# Altium schematic sheet Input_Power.SchDoc
size A; SheetNumber: 5; SheetTotal: 6
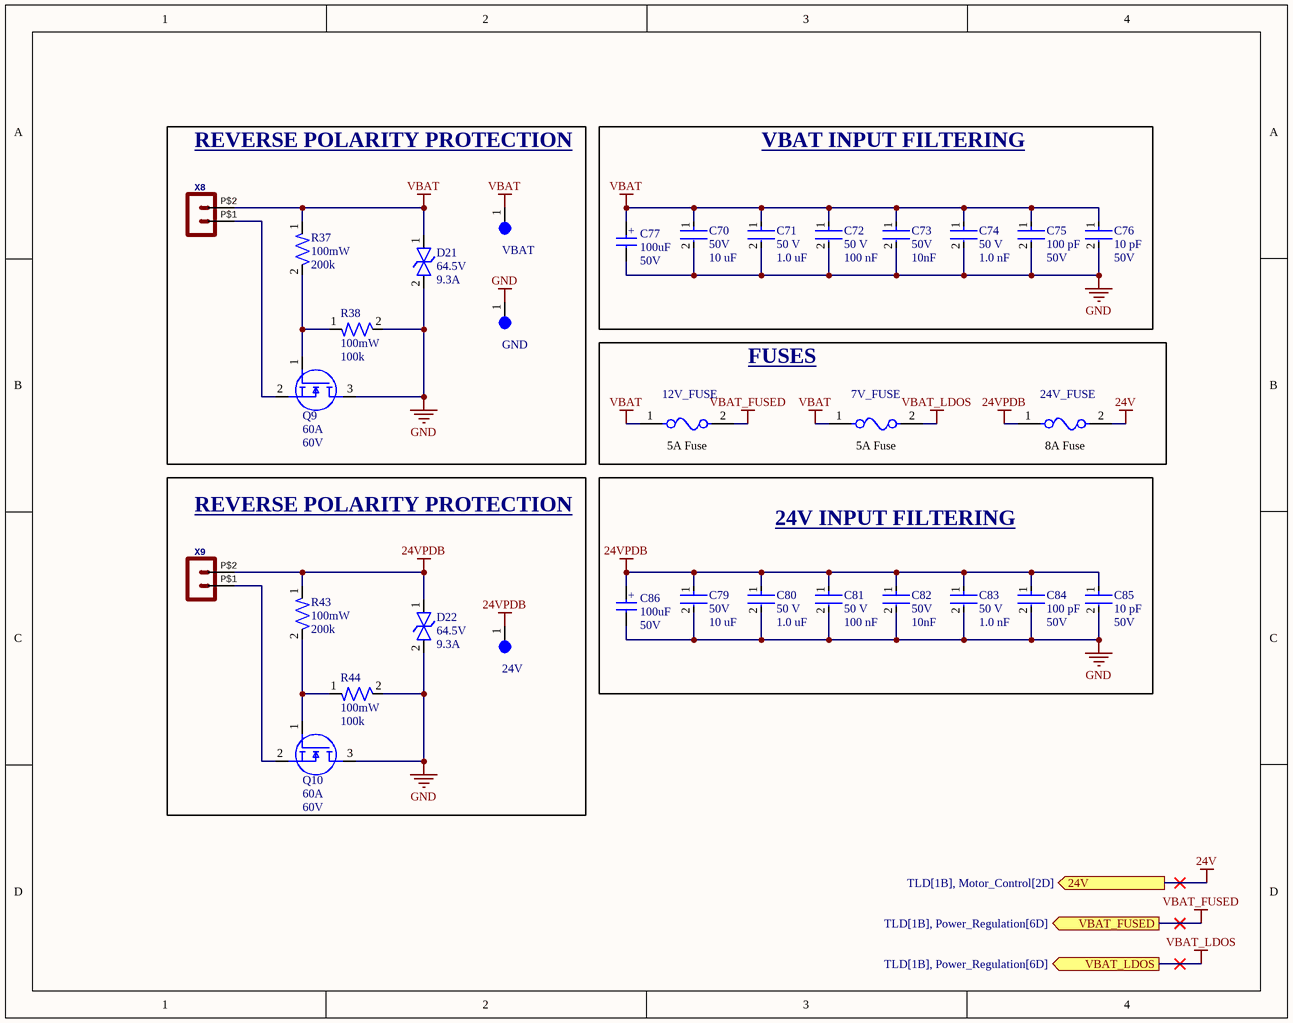
[diagram p0: Input_Power.SchDoc]

## Parts
7V_FUSE  01550900M  [FUSE-0001]  (value not drawn)
12V_FUSE  01550900M  [FUSE-0001]  (value not drawn)
24V  5003  [TEST-POINT-0001]  (value not drawn)
24V_FUSE  01550900M  [FUSE-0001]  (value not drawn)
C70  Voltage: 50V  Capacitance: 10 uF  [CAP-1210]  (hidden comment: CL32B106KBJNNNE)
C71  Voltage: 50 V  Capacitance: 1.0 uF  [CAP-0805]  (hidden comment: CC0805KKX7R9BB105)
C72  Voltage Rating: 50 V  Capacitance: 100 nF  [CAP-0805]  (hidden comment: CC0805KRX7R9BB104)
C73  Voltage: 50V  Capacitance: 10nF  [CAP-0805]  (hidden comment: GRM2195C1H103JA01D)
C74  Voltage: 50 V  Capacitance: 1.0 nF  [CAP-0402]  (hidden comment: CC0402KRX7R9BB102)
C75  Capacitance: 100 pF  Voltage: 50V  [CAP-0402]  (hidden comment: CC0402JRNPO9BN101)
C76  Capacitance: 10 pF  Voltage: 50V  [CAP-0402]  (hidden comment: CC0402JRNPO9BN100)
C77  Capacitance: 100uF  Voltage: 50V  [WCAP-ATUL_8X11.5(DXL)]  (hidden comment: 860040674004)
C79  Voltage: 50V  Capacitance: 10 uF  [CAP-1210]  (hidden comment: CL32B106KBJNNNE)
C80  Voltage: 50 V  Capacitance: 1.0 uF  [CAP-0805]  (hidden comment: CC0805KKX7R9BB105)
C81  Voltage Rating: 50 V  Capacitance: 100 nF  [CAP-0805]  (hidden comment: CC0805KRX7R9BB104)
C82  Voltage: 50V  Capacitance: 10nF  [CAP-0805]  (hidden comment: GRM2195C1H103JA01D)
C83  Voltage: 50 V  Capacitance: 1.0 nF  [CAP-0402]  (hidden comment: CC0402KRX7R9BB102)
C84  Capacitance: 100 pF  Voltage: 50V  [CAP-0402]  (hidden comment: CC0402JRNPO9BN101)
C85  Capacitance: 10 pF  Voltage: 50V  [CAP-0402]  (hidden comment: CC0402JRNPO9BN100)
C86  Capacitance: 100uF  Voltage: 50V  [WCAP-ATUL_8X11.5(DXL)]  (hidden comment: 860040674004)
D21  Voltage Rating: 64.5V  Current Rating: 9.3A  [DO-214AA (SMBJ)]  (hidden comment: SMBJ40CA)
D22  Voltage Rating: 64.5V  Current Rating: 9.3A  [DO-214AA (SMBJ)]  (hidden comment: SMBJ40CA)
GND  5003  [TEST-POINT-0001]  (value not drawn)
Q9  Voltage: 60V  Continuous Current: 60A  [IC-8VSONCLIP]  (hidden comment: CSD18543Q3AT)
Q10  Voltage: 60V  Continuous Current: 60A  [IC-8VSONCLIP]  (hidden comment: CSD18543Q3AT)
R37  Power: 100mW  Resistance: 200k  [RES-0603]  (hidden comment: RC0603FR-07200KL)
R38  Power: 100mW  Resistance: 100k  [RES-0603]  (hidden comment: RC0603FR-07100KL)
R43  Power: 100mW  Resistance: 200k  [RES-0603]  (hidden comment: RC0603FR-07200KL)
R44  Power: 100mW  Resistance: 100k  [RES-0603]  (hidden comment: RC0603FR-07100KL)
VBAT  5003  [TEST-POINT-0001]  (value not drawn)
X8  Molex - Micro-Fit 3.0 Series connector,  3.00mm (0.118") pitch header, 2 positions.  [43045-0200]  (value not drawn)
X9  Molex - Micro-Fit 3.0 Series connector,  3.00mm (0.118") pitch header, 2 positions.  [43045-0200]  (value not drawn)

## Blocks framed on the sheet
REVERSE POLARITY PROTECTION: D21 GND Q9 R37 R38 VBAT X8
VBAT INPUT FILTERING: C70-C77
FUSES: 7V_FUSE 12V_FUSE 24V_FUSE
REVERSE POLARITY PROTECTION: 24V D22 Q10 R43 R44 X9
24V INPUT FILTERING: C79-C86

## Ports
24V (out, see TLD[1B], Motor_Control[2D]), VBAT_FUSED (out, see TLD[1B], Power_Regulation[6D]), VBAT_LDOS (out, see TLD[1B], Power_Regulation[6D])

## Nets
24V: 24V_FUSE.2 ; port 24V
24VPDB: 24V.1 24V_FUSE.1 C79.1 C80.1 C81.1 C82.1 C83.1 C84.1 C85.1 C86.1(POS) D22.1 R43.1 X9.P$2
GND: C70.2 C71.2 C72.2 C73.2 C74.2 C75.2 C76.2 C77.2(NEG) C79.2 C80.2 C81.2 C82.2 C83.2 C84.2 C85.2 C86.2(NEG) D21.2 D22.2 GND.1 Q9.3(D) Q10.3(D) R38.2 R44.2
VBAT: 7V_FUSE.1 12V_FUSE.1 C70.1 C71.1 C72.1 C73.1 C74.1 C75.1 C76.1 C77.1(POS) D21.1 R37.1 VBAT.1 X8.P$2
VBAT_FUSED: 12V_FUSE.2 ; port VBAT_FUSED
VBAT_LDOS: 7V_FUSE.2 ; port VBAT_LDOS
NetQ9_1: Q9.1(G) R37.2 R38.1
NetQ9_2: Q9.2(S) X8.P$1
NetQ10_1: Q10.1(G) R43.2 R44.1
NetQ10_2: Q10.2(S) X9.P$1

## Notes on the sheet
- (near 12V_FUSE) 5A Fuse
- (near 7V_FUSE) 5A Fuse
- (near 24V_FUSE) 8A Fuse
- (in symbol CAP-100u-0001) +

## Library data of the parts
7V_FUSE 12V_FUSE 24V_FUSE = FUSE-0001: FUSE BLOK CARTRIDGE 125V 10A SMD; Fuse Current: 8A; ComponentLink2Description: Datasheet; ComponentLink2URL: https://www.littelfuse.com/~/media/electronics/datasheets/fuses/littelfuse_fuse_154_154t_154l_154tl_datasheet.pdf.pdf; Voltage Rating: 125V
24V GND VBAT = TEST-POINT-0001: Oranange PC Test Point, Miniature Phoisphor Bronze Silver Plating Through Hole Mounting Type
C70 C79 = CAP-10U-0002: CAP CER 10UF 50V X7R 1210; Device Class: Ceramic; Size: 1210; ComponentLink1Description: Datasheet; ComponentLink1URL: https://mm.digikey.com/Volume0/opasdata/d220001/medias/docus/41/CL32B106KBJNNNE_Spec.pdf
C71 C80 = CAP-1U-0001: CAP CER 1UF 50V X7R 0805; ComponentLink2URL: https://www.yageo.com/upload/media/product/productsearch/datasheet/mlcc/UPY-GPHC_X7R_6.3V-to-250V_24.pdf; ComponentLink2Description: Datasheet; Device Class: Ceramic; Size: 0805
C72 C81 = CAP-0.1U-0002: CAP CER 0.1UF 50V X7R 0805; ComponentLink2Description: Datasheet; ComponentLink2URL: https://www.yageo.com/upload/media/product/productsearch/datasheet/mlcc/UPY-GPHC_X7R_6.3V-to-250V_24.pdf; Device Class: Ceramic; Size: 0805
C73 C82 = CAP-10N-0001: CAP CER 10000PF 50V C0G/NP0 0805; Device Class: Ceramic; Size: 0805; ComponentLink1Description: Datasheet; ComponentLink1URL: https://search.murata.co.jp/Ceramy/image/img/A01X/G101/ENG/GRM2195C1H103JA01-01.pdf
C74 C83 = CAP-1N-0001: CAP CER 1000PF 50V X7R 0402; ComponentLink2Description: Datasheet; ComponentLink2URL: http://www.yageo.com/documents/recent/UPY-GP_NP0_16V-to-50V_16.pdf; Device Class: Ceramic; Size: 0402
C75 C84 = CAP-100P-0001: CAP CER 100PF 50V C0G/NPO 0402; Device Class: Ceramic; Size: 0402; ComponentLink1Description: Datasheet; ComponentLink1URL: https://www.yageo.com/upload/media/product/productsearch/datasheet/mlcc/UPY-GP_NP0_16V-to-50V_18.pdf
C76 C85 = CAP-10P-0001: CAP CER 10PF 50V C0G/NPO 0402; Device Class: Ceramic; Size: 0402; ComponentLink1Description: Datasheet; ComponentLink1URL: https://www.yageo.com/upload/media/product/productsearch/datasheet/mlcc/UPY-GP_NP0_16V-to-50V_18.pdf
C77 C86 = CAP-100u-0001: 100 µF 50 V Aluminum Electrolytic Capacitors Radial, Can 7000 Hrs @ 105°C; MF: {'manufacturer': u'W\xfcrth Elektronik'}; Package: None; Price: None; MP: 860040674004; Availability: Unavailable; ComponentLink1Description: Datasheet; ComponentLink1URL: https://www.we-online.com/components/products/datasheet/860040674004.pdf
D21 D22 = DIO-TVS-0001: TVS DIODE 40VWM 64.5VC DO214AA; ComponentLink1Description: Datasheet; ComponentLink1URL: https://www.littelfuse.com/media?resourcetype=datasheets&itemid=09a6ae9a-73cb-4ac4-acac-e6dab92ab953&filename=littelfuse_tvs_diode_smbj_datasheet.pdf
Q9 Q10 = NMOS-60A-0001: MOSFET N-CH 60V 12A/60A 8VSON; ComponentLink2Description: Datasheet; ComponentLink2URL: http://www.ti.com/lit/ds/symlink/csd18543q3a.pdf
R37 R43 = RES-200k-0001: RES SMD 200K OHM 1% 1/10W 0603; Tolerance: 1%; Size: 0603; ComponentLink1Description: Datasheet; ComponentLink1URL: https://www.yageo.com/upload/media/product/products/datasheet/rchip/PYu-RC_Group_51_RoHS_L_12.pdf
R38 R44 = RES-100k-0001: RES SMD 100K OHM 1% 1/10W 0603; Tolerance: 1%; Size: 0603; ComponentLink1Description: Datasheet; ComponentLink1URL: https://www.yageo.com/upload/media/product/products/datasheet/rchip/PYu-RC_Group_51_RoHS_L_12.pdf
X8 X9 = HEADER_POS2_43045-0200: GateName_1: G$1; DeviceSetName: HEADER_POS2_?; SymbolName_1: HEADER_POS2; DeviceName: 43045-0200; LibraryName: con-molex-micro-fit-3_0_2; Package: 43045-0200